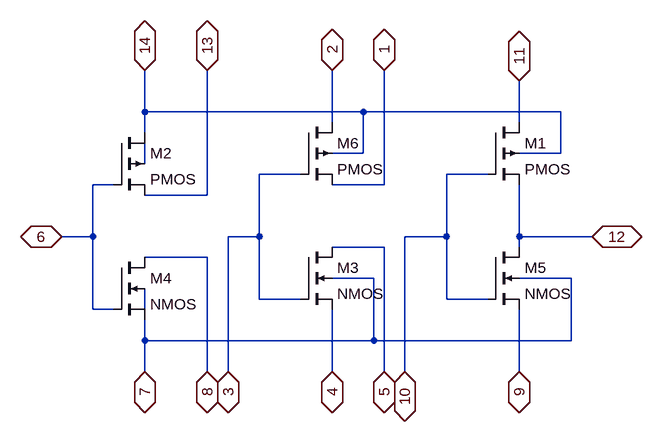
[diagram p0: schematic 4007_cmos.asc]
4007_cmos.asc, the LTspice schematic file:
Version 4
SHEET 1 880 680
WIRE -240 -16 -240 -80
WIRE 96 -16 -240 -16
WIRE 400 -16 96 -16
WIRE 48 0 48 -80
WIRE 336 0 336 -64
WIRE -240 16 -240 -16
WIRE 96 48 96 -16
WIRE 96 48 48 48
WIRE 400 48 400 -16
WIRE 400 48 336 48
WIRE -240 64 -240 32
WIRE 0 80 -64 80
WIRE 288 80 224 80
WIRE -288 96 -320 96
WIRE 128 96 128 -80
WIRE 128 96 48 96
WIRE -144 112 -144 -80
WIRE -144 112 -240 112
WIRE -320 176 -320 96
WIRE -320 176 -368 176
WIRE -64 176 -64 80
WIRE -64 176 -112 176
WIRE 224 176 224 80
WIRE 224 176 160 176
WIRE 336 176 336 96
WIRE 448 176 336 176
WIRE 128 192 48 192
WIRE 336 192 336 176
WIRE -144 208 -240 208
WIRE 112 240 48 240
WIRE 416 240 336 240
WIRE -64 272 -64 176
WIRE 0 272 -64 272
WIRE 224 272 224 176
WIRE 288 272 224 272
WIRE -320 288 -320 176
WIRE -288 288 -320 288
WIRE -240 288 -240 256
WIRE -240 336 -240 304
WIRE 112 336 112 240
WIRE 112 336 -240 336
WIRE 416 336 416 240
WIRE 416 336 112 336
WIRE -240 384 -240 336
WIRE -144 384 -144 208
WIRE -112 384 -112 176
WIRE 48 384 48 288
WIRE 128 384 128 192
WIRE 160 384 160 176
WIRE 336 384 336 288
FLAG 128 -80 1
IOPIN 128 -80 BiDir
FLAG 48 -80 2
IOPIN 48 -80 BiDir
FLAG -112 384 3
IOPIN -112 384 BiDir
FLAG -144 384 8
IOPIN -144 384 BiDir
FLAG -240 384 7
IOPIN -240 384 BiDir
FLAG 448 176 12
IOPIN 448 176 BiDir
FLAG -240 -80 14
IOPIN -240 -80 BiDir
FLAG -144 -80 13
IOPIN -144 -80 BiDir
FLAG 48 384 4
IOPIN 48 384 BiDir
FLAG 128 384 5
IOPIN 128 384 BiDir
FLAG 336 384 9
IOPIN 336 384 BiDir
FLAG -368 176 6
IOPIN -368 176 BiDir
FLAG 336 -64 11
IOPIN 336 -64 BiDir
FLAG 160 384 10
IOPIN 160 384 BiDir
SYMBOL pmos4 288 0 R0
SYMATTR InstName M1
SYMBOL pmos4 -288 16 R0
SYMATTR InstName M2
SYMBOL nmos4 0 192 R0
SYMATTR InstName M3
SYMBOL nmos4 -288 208 R0
SYMATTR InstName M4
SYMBOL nmos4 288 192 R0
SYMATTR InstName M5
SYMBOL pmos4 0 0 R0
SYMATTR InstName M6

The netlist it stands for:
* 4007_cmos.asc
M1 11 10 12 14 PMOS
M2 14 6 13 N001 PMOS
M3 5 3 4 7 NMOS
M4 8 6 7 N002 NMOS
M5 12 10 9 7 NMOS
M6 2 3 1 14 PMOS
.model NMOS NMOS
.model PMOS PMOS
.lib standard.mos
.backanno
.end